# EAGLE design Child (EAGLE 7.4.0)
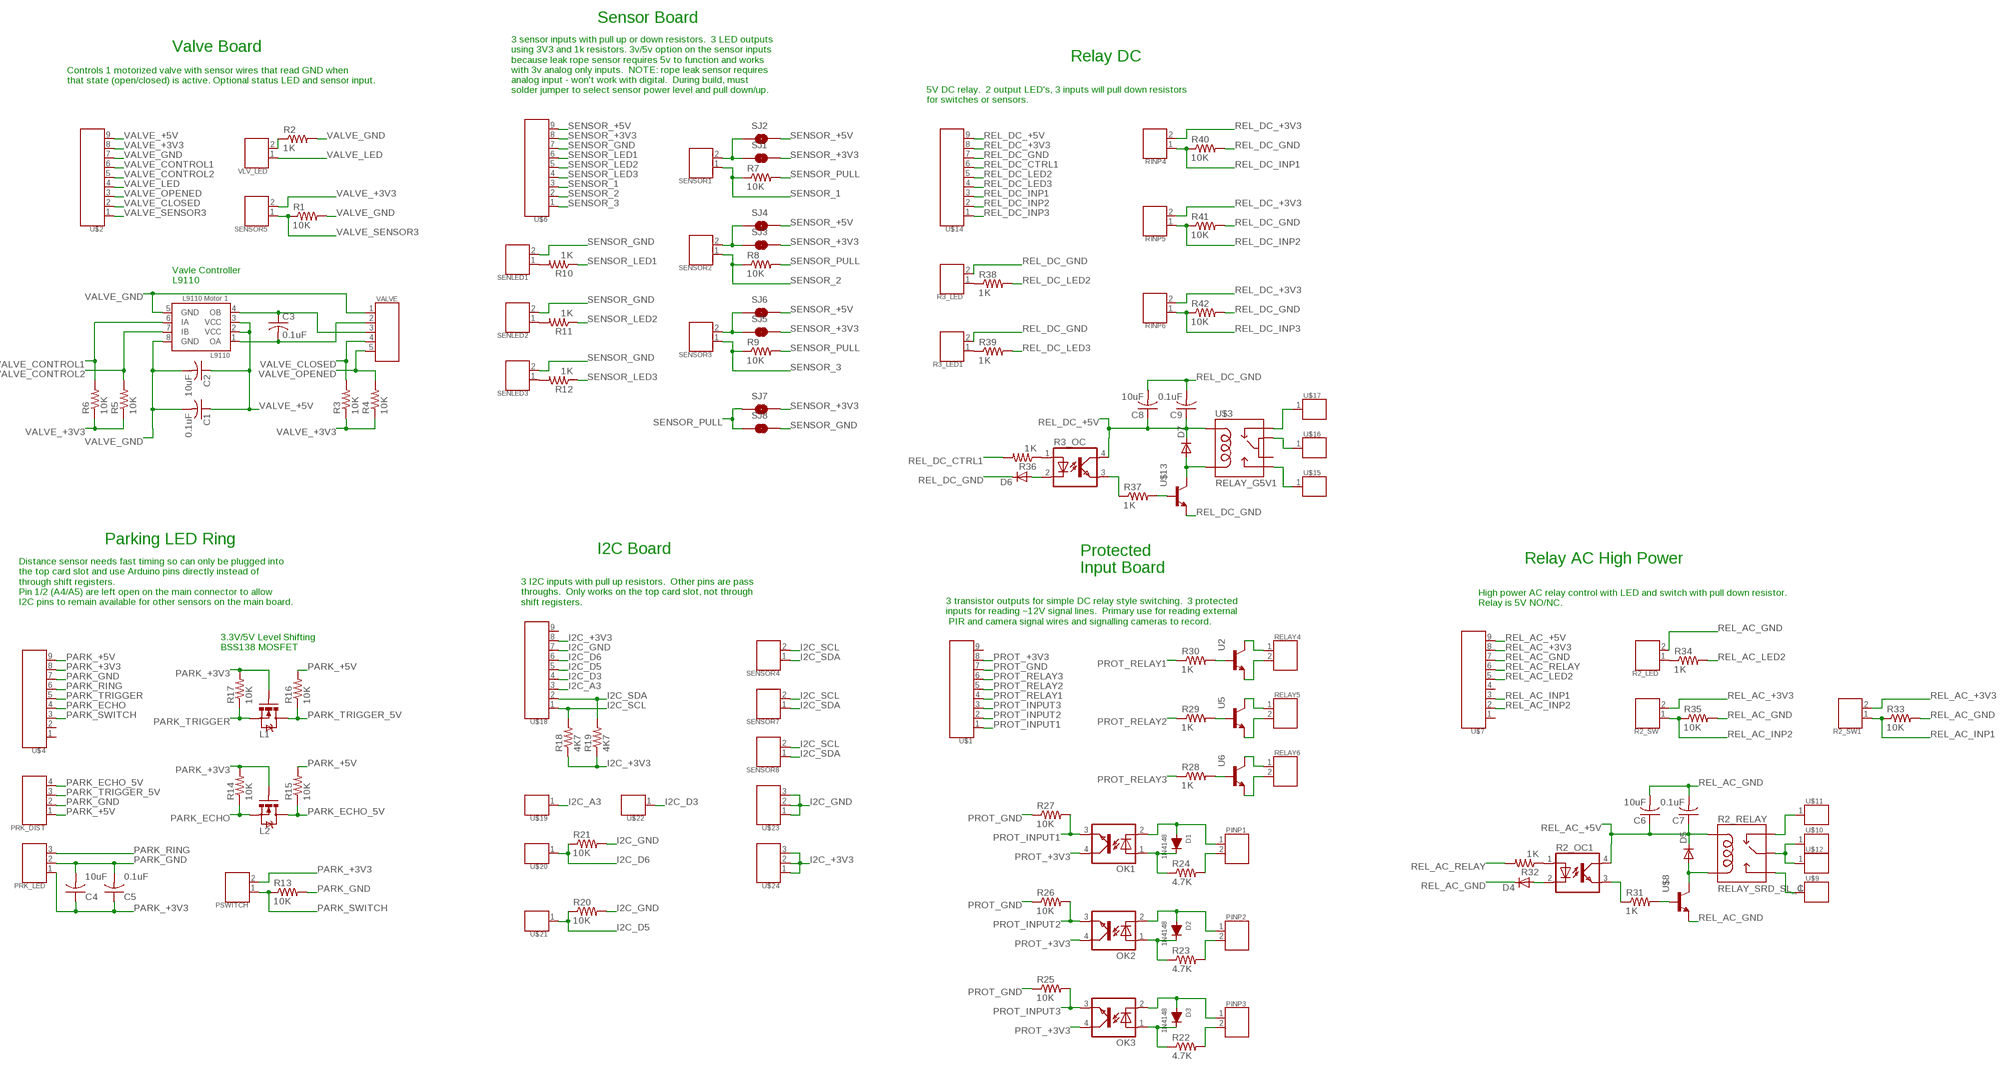
[diagram p0: schematic, sheet 1]

## Parts
C1  0.1uF  CAP_0805  [CAP_0805]
C2  10uF  CAP_0805  [CAP_0805]
C3  0.1uF  CAP_0805  [CAP_0805]
C4  10uF  CAP_0805  [CAP_0805]
C5  0.1uF  CAP_0805  [CAP_0805]
C6  10uF  CAP_0805  [CAP_0805]
C7  0.1uF  CAP_0805  [CAP_0805]
C8  10uF  CAP_0805  [CAP_0805]
C9  0.1uF  CAP_0805  [CAP_0805]
D1  1N4148  1N4148_SOD123  [SOD123]
D2  1N4148  1N4148_SOD123  [SOD123]
D3  1N4148  1N4148_SOD123  [SOD123]
D4  DIODESOD323  [SOD323]
D5  DIODESOD323  [SOD323]
D6  DIODESOD323  [SOD323]
D7  DIODESOD323  [SOD323]
L1  MOSFET-NCHANNELSMD  [SOT23-3]
L2  MOSFET-NCHANNELSMD  [SOT23-3]
L9110  L9110 Motor 1  IC_L9110_MOTORSO8  [SO-08]
OK1  PC817SOP  [SO-4_PC817]
OK2  PC817SOP  [SO-4_PC817]
OK3  PC817SOP  [SO-4_PC817]
PINP1  CONNECTOR_2DUPONT  [DUPONT_2]
PINP2  CONNECTOR_2DUPONT  [DUPONT_2]
PINP3  CONNECTOR_2DUPONT  [DUPONT_2]
PRK_DIST  CONNECTOR_4DUPONT  [DUPONT_4]
PRK_LED  CONNECTOR_3DUPONT  [DUPONT_3]
PSWITCH  CONNECTOR_2DUPONT  [DUPONT_2]
R1  10K  R_0805  [R_0805]
R2  1K  R_0805  [R_0805]
R2_LED  CONNECTOR_2DUPONT  [DUPONT_2]
R2_OC1  PC817SOP  [SO-4_PC817]
R2_RELAY  RELAY_SRD_SL_C  [RELAY_SRD-SL-C]
R2_SW  CONNECTOR_2DUPONT  [DUPONT_2]
R2_SW1  CONNECTOR_2DUPONT  [DUPONT_2]
R3  10K  R_0805  [R_0805]
R3_LED  CONNECTOR_2DUPONT  [DUPONT_2]
R3_LED1  CONNECTOR_2DUPONT  [DUPONT_2]
R3_OC  PC817SOP  [SO-4_PC817]
R4  10K  R_0805  [R_0805]
R5  10K  R_0805  [R_0805]
R6  10K  R_0805  [R_0805]
R7  10K  R_0805  [R_0805]
R8  10K  R_0805  [R_0805]
R9  10K  R_0805  [R_0805]
R10  1K  R_0805  [R_0805]
R11  1K  R_0805  [R_0805]
R12  1K  R_0805  [R_0805]
R13  10K  R_0805  [R_0805]
R14  10K  R_0805  [R_0805]
R15  10K  R_0805  [R_0805]
R16  10K  R_0805  [R_0805]
R17  10K  R_0805  [R_0805]
R18  4K7  R_0805  [R_0805]
R19  4K7  R_0805  [R_0805]
R20  10K  R_0805  [R_0805]
R21  10K  R_0805  [R_0805]
R22  4.7K  R_0805  [R_0805]
R23  4.7K  R_0805  [R_0805]
R24  4.7K  R_0805  [R_0805]
R25  10K  R_0805  [R_0805]
R26  10K  R_0805  [R_0805]
R27  10K  R_0805  [R_0805]
R28  1K  R_0805  [R_0805]
R29  1K  R_0805  [R_0805]
R30  1K  R_0805  [R_0805]
R31  1K  R_0805  [R_0805]
R32  1K  R_0805  [R_0805]
R33  10K  R_0805  [R_0805]
R34  1K  R_0805  [R_0805]
R35  10K  R_0805  [R_0805]
R36  1K  R_0805  [R_0805]
R37  1K  R_0805  [R_0805]
R38  1K  R_0805  [R_0805]
R39  1K  R_0805  [R_0805]
R40  10K  R_0805  [R_0805]
R41  10K  R_0805  [R_0805]
R42  10K  R_0805  [R_0805]
RELAY4  CONNECTOR_2DUPONT  [DUPONT_2]
RELAY5  CONNECTOR_2DUPONT  [DUPONT_2]
RELAY6  CONNECTOR_2DUPONT  [DUPONT_2]
RINP4  CONNECTOR_2DUPONT  [DUPONT_2]
RINP5  CONNECTOR_2DUPONT  [DUPONT_2]
RINP6  CONNECTOR_2DUPONT  [DUPONT_2]
SENLED1  CONNECTOR_2DUPONT  [DUPONT_2]
SENLED2  CONNECTOR_2DUPONT  [DUPONT_2]
SENLED3  CONNECTOR_2DUPONT  [DUPONT_2]
SENSOR1  CONNECTOR_2DUPONT  [DUPONT_2]
SENSOR2  CONNECTOR_2DUPONT  [DUPONT_2]
SENSOR3  CONNECTOR_2DUPONT  [DUPONT_2]
SENSOR4  CONNECTOR_2DUPONT  [DUPONT_2]
SENSOR5  CONNECTOR_2DUPONT  [DUPONT_2]
SENSOR7  CONNECTOR_2DUPONT  [DUPONT_2]
SENSOR8  CONNECTOR_2DUPONT  [DUPONT_2]
SJ1  JUMPER-PAD-2-NOYES_SILK  [PAD-JUMPER-2-NO_YES_SILK]
SJ2  JUMPER-PAD-2-NOYES_SILK  [PAD-JUMPER-2-NO_YES_SILK]
SJ3  JUMPER-PAD-2-NOYES_SILK  [PAD-JUMPER-2-NO_YES_SILK]
SJ4  JUMPER-PAD-2-NOYES_SILK  [PAD-JUMPER-2-NO_YES_SILK]
SJ5  JUMPER-PAD-2-NOYES_SILK  [PAD-JUMPER-2-NO_YES_SILK]
SJ6  JUMPER-PAD-2-NOYES_SILK  [PAD-JUMPER-2-NO_YES_SILK]
SJ7  JUMPER-PAD-2-NOYES_SILK  [PAD-JUMPER-2-NO_YES_SILK]
SJ8  JUMPER-PAD-2-NOYES_SILK  [PAD-JUMPER-2-NO_YES_SILK]
U2  TRANSISTORSMD  [SOT23-3]
U5  TRANSISTORSMD  [SOT23-3]
U6  TRANSISTORSMD  [SOT23-3]
U$1  CONNECTOR_9DUP_FEM90  [DUPONT_FEM90_9]
U$2  CONNECTOR_9DUP_FEM90  [DUPONT_FEM90_9]
U$3  RELAY_G5V1  [RELAY-G5V]
U$4  CONNECTOR_9DUPONT  [DUPONT_9]
U$6  CONNECTOR_9DUP_FEM90  [DUPONT_FEM90_9]
U$7  CONNECTOR_9DUP_FEM90  [DUPONT_FEM90_9]
U$8  TRANSISTORSMD  [SOT23-3]
U$9  CONNECTOR_1DUP_LARGE  [DUPONT_1_LRG]
U$10  CONNECTOR_1DUP_LARGE  [DUPONT_1_LRG]
U$11  CONNECTOR_1DUP_LARGE  [DUPONT_1_LRG]
U$12  CONNECTOR_1DUP_LARGE  [DUPONT_1_LRG]
U$13  TRANSISTORSMD  [SOT23-3]
U$14  CONNECTOR_9DUP_FEM90  [DUPONT_FEM90_9]
U$15  CONNECTOR_1DUPONT  [DUPONT_1]
U$16  CONNECTOR_1DUPONT  [DUPONT_1]
U$17  CONNECTOR_1DUPONT  [DUPONT_1]
U$18  CONNECTOR_9DUP_FEM90  [DUPONT_FEM90_9]
U$19  CONNECTOR_1DUPONT  [DUPONT_1]
U$20  CONNECTOR_1DUPONT  [DUPONT_1]
U$21  CONNECTOR_1DUPONT  [DUPONT_1]
U$22  CONNECTOR_1DUPONT  [DUPONT_1]
U$23  CONNECTOR_3DUPONT  [DUPONT_3]
U$24  CONNECTOR_3DUPONT  [DUPONT_3]
VALVE  CONNECTOR_5DUPONT  [DUPONT_5]
VLV_LED  CONNECTOR_2DUPONT  [DUPONT_2]

## Nets
I2C_+3V3: R18.1 R19.1 U$18.8 U$24.1 U$24.2 U$24.3
I2C_A3: U$18.3 U$19.1
I2C_D3: U$18.4 U$22.1
I2C_D5: R20.1 U$18.5 U$21.1
I2C_D6: R21.1 U$18.6 U$20.1
I2C_GND: R20.2 R21.2 U$18.7 U$23.1 U$23.2 U$23.3
I2C_SCL: R18.2 SENSOR4.2 SENSOR7.2 SENSOR8.2 U$18.1
I2C_SDA: R19.2 SENSOR4.1 SENSOR7.1 SENSOR8.1 U$18.2
N$3: C3.1 L9110.4(OB) VALVE.3
N$4: C3.2 L9110.1(OA) VALVE.2
N$5: R2.1 VLV_LED.2
N$6: D1.C(K) OK1.1 R24.1
N$7: D1.A OK1.2 PINP1.1
N$8: PINP1.2 R24.2
N$9: D2.C(K) OK2.1 R23.1
N$10: D2.A OK2.2 PINP2.1
N$11: PINP2.2 R23.2
N$13: D3.C(K) OK3.1 R22.1
N$14: D3.A OK3.2 PINP3.1
N$15: PINP3.2 R22.2
N$16: R10.2 SENLED1.1
N$17: R11.2 SENLED2.1
N$18: R12.2 SENLED3.1
N$19: R30.2 U2.1(BASE)
N$21: RELAY4.1 U2.3(COLLECTOR)
N$22: RELAY4.2 U2.2(EMITTER)
N$26: SENSOR3.2 SJ5.1 SJ6.1
N$27: SENSOR2.2 SJ3.1 SJ4.1
N$28: R29.2 U5.1(BASE)
N$29: R28.2 U6.1(BASE)
N$30: R3_LED1.1 R39.1
N$31: RELAY5.1 U5.3(COLLECTOR)
N$32: RELAY5.2 U5.2(EMITTER)
N$33: RELAY6.1 U6.3(COLLECTOR)
N$34: RELAY6.2 U6.2(EMITTER)
N$35: R2_LED.1 R34.1
N$36: D5.A R2_RELAY.2(COIL_B) U$8.3(COLLECTOR)
N$37: R31.2 U$8.1(BASE)
N$38: R2_OC1.3(EMIT) R31.1
N$39: D4.A R2_OC1.2
N$40: R2_OC1.1 R32.1
N$41: D7.A U$3.9 U$13.3(COLLECTOR)
N$42: R37.2 U$13.1(BASE)
N$43: R3_OC.3(EMIT) R37.1
N$44: D6.A R3_OC.2
N$45: R3_OC.1 R36.1
N$46: R3_LED.1 R38.1
N$47: U$3.5 U$16.1
N$48: SENSOR1.2 SJ1.1 SJ2.1
PARK_+3V3: C4.1 C5.1 L1.1(G) L2.1(G) PRK_LED.1 PSWITCH.2 R14.2 R17.2 U$4.8
PARK_+5V: PRK_DIST.1 R15.2 R16.2 U$4.9
PARK_ECHO: L2.2(S) R14.1 U$4.4
PARK_ECHO_5V: L2.3(D) PRK_DIST.4 R15.1
PARK_GND: C4.2 C5.2 PRK_DIST.2 PRK_LED.2 R13.2 U$4.7
PARK_RING: PRK_LED.3 U$4.6
PARK_SWITCH: PSWITCH.1 R13.1 U$4.3
PARK_TRIGGER: L1.2(S) R17.1 U$4.5
PARK_TRIGGER_5V: L1.3(D) PRK_DIST.3 R16.1
PROT_+3V3: OK1.4(COL) OK2.4(COL) OK3.4(COL) U$1.8
PROT_GND: R25.1 R26.1 R27.1 U$1.7
PROT_INPUT1: OK1.3(EMIT) R27.2 U$1.1
PROT_INPUT2: OK2.3(EMIT) R26.2 U$1.2
PROT_INPUT3: OK3.3(EMIT) R25.2 U$1.3
PROT_RELAY1: R30.1 U$1.4
PROT_RELAY2: R29.1 U$1.5
PROT_RELAY3: R28.1 U$1.6
R2_COM: R2_RELAY.3(COM) U$10.1 U$12.1
R2_NC: R2_RELAY.5(NC) U$11.1
R2_NC1: U$3.1 U$17.1
R2_NO: R2_RELAY.4(NO) U$9.1
R2_NO1: U$3.10 U$15.1
REL_AC_+3V3: R2_SW1.2 R2_SW.2 U$7.8
REL_AC_+5V: C6.1 C7.1 D5.C R2_OC1.4(COL) R2_RELAY.1(COIL_A) U$7.9
REL_AC_GND: C6.2 C7.2 D4.C R2_LED.2 R33.2 R35.2 U$7.7 U$8.2(EMITTER)
REL_AC_INP1: R2_SW1.1 R33.1 U$7.3
REL_AC_INP2: R2_SW.1 R35.1 U$7.2
REL_AC_LED2: R34.2 U$7.5
REL_AC_RELAY: R32.2 U$7.6
REL_DC_+3V3: RINP4.2 RINP5.2 RINP6.2 U$14.8
REL_DC_+5V: C8.1 C9.1 D7.C R3_OC.4(COL) U$3.2 U$14.9
REL_DC_CTRL1: R36.2 U$14.6
REL_DC_GND: C8.2 C9.2 D6.C R3_LED1.2 R3_LED.2 R40.2 R41.2 R42.2 U$13.2(EMITTER) U$14.7
REL_DC_INP1: R40.1 RINP4.1 U$14.3
REL_DC_INP2: R41.1 RINP5.1 U$14.2
REL_DC_INP3: R42.1 RINP6.1 U$14.1
REL_DC_LED2: R38.2 U$14.5
REL_DC_LED3: R39.2 U$14.4
SENSOR_1: R7.1 SENSOR1.1 U$6.3
SENSOR_2: R8.1 SENSOR2.1 U$6.2
SENSOR_3: R9.1 SENSOR3.1 U$6.1
SENSOR_+3V3: SJ1.2 SJ3.2 SJ5.2 SJ7.2 U$6.8
SENSOR_+5V: SJ2.2 SJ4.2 SJ6.2 U$6.9
SENSOR_GND: SENLED1.2 SENLED2.2 SENLED3.2 SJ8.2 U$6.7
SENSOR_LED1: R10.1 U$6.6
SENSOR_LED2: R11.1 U$6.5
SENSOR_LED3: R12.1 U$6.4
SENSOR_PULL: R7.2 R8.2 R9.2 SJ7.1 SJ8.1
VALVE_+3V3: R3.1 R4.1 R5.1 R6.1 SENSOR5.2 U$2.8
VALVE_+5V: C1.1 C2.1 L9110.2(VCC) L9110.3(VCC) U$2.9
VALVE_CLOSED: R3.2 U$2.2 VALVE.4
VALVE_CONTROL1: L9110.6(IA) R6.2 U$2.6
VALVE_CONTROL2: L9110.7(IB) R5.2 U$2.5
VALVE_GND: C1.2 C2.2 L9110.5(GND) L9110.8(GND) R1.2 R2.2 U$2.7 VALVE.1
VALVE_LED: U$2.4 VLV_LED.1
VALVE_OPENED: R4.2 U$2.3 VALVE.5
VALVE_SENSOR3: R1.1 SENSOR5.1 U$2.1
Unconnected: U$1.9 U$3.6 U$4.1 U$4.2 U$7.1 U$7.4 U$18.9

## Notes on the sheet
- Sensor Board
- Valve Board
- Relay DC
- Controls 1 motorized valve with sensor wires that read GND when 
  that state (open/closed) is active. Optional status LED and sensor input.
- 3 sensor inputs with pull up or down resistors.  3 LED outputs
  using 3V3 and 1k resistors. 3v/5v option on the sensor inputs
  because leak rope sensor requires 5v to function and works
  with 3v analog only inputs.  NOTE: rope leak sensor requires
  analog input - won't work with digital.  During build, must 
  solder jumper to select sensor power level and pull down/up.
- 5V DC relay.  2 output LED's, 3 inputs will pull down resistors
  for switches or sensors.
- Vavle Controller
  L9110
- Parking LED Ring
- I2C Board
- Relay AC High Power
- Protected
  Input Board
- Distance sensor needs fast timing so can only be plugged into
  the top card slot and use Arduino pins directly instead of 
  through shift registers.  
  Pin 1/2 (A4/A5) are left open on the main connector to allow
  I2C pins to remain available for other sensors on the main board.
- 3 I2C inputs with pull up resistors.  Other pins are pass
  throughs.  Only works on the top card slot, not through
  shift registers.
- High power AC relay control with LED and switch with pull down resistor.
  Relay is 5V NO/NC.
- 3 transistor outputs for simple DC relay style switching.  3 protected
  inputs for reading ~12V signal lines.  Primary use for reading external
   PIR and camera signal wires and signalling cameras to record.
- 3.3V/5V Level Shifting
  BSS138 MOSFET

## Library data of the parts
C1-C9 = TD22057:CAP_0805
D1-D3 = diodes:1N4148: General purpose diode 1N4148W Datasheet: \diodes-datasheets\1N4148W.pdf Features: • Fast switching device (TRR<4 nS) • General purpose diodes • Flat lead SOD-123 small outline plastic package • Surface device type mounting • Moisture sensitivity level 1 • Clip bonding construction, good thermal capability • Pb free version • Matte tin (Sn) lead finish with nickel (Ni) underplate • Band indicates cathode Electrical Characteristics Power Dissipation 400mW Repetitive Peak Reverse Voltage 75V Continuous Forward Current 150mA; MPN: 1N4148W; OC_FARNELL: 1651821; PACKAGE: SOD123; SUPPLIER: MULTICOMP
D4-D7 = TD22057:DIODE: DIODE high speed (Philips)
L1 L2 = TD22057:MOSFET-NCHANNEL: BSS138 Logic Level converter 5V->3.3V
L9110 = TD22057:IC_L9110_MOTOR
OK1-OK3 R2_OC1 R3_OC = TD22057:PC817: EL817 Opto Coupler
PINP1-PINP3 PSWITCH R2_LED R2_SW R2_SW1 R3_LED R3_LED1 RELAY4-RELAY6 RINP4-RINP6 SENLED1-SENLED3 SENSOR1-SENSOR5 SENSOR7 SENSOR8 VLV_LED = TD22057:CONNECTOR_2: 2 Pin connector
PRK_DIST = TD22057:CONNECTOR_4
PRK_LED U$23 U$24 = TD22057:CONNECTOR_3
R1-R42 = TD22057:R_0805
R2_RELAY = TD22057:RELAY_SRD_SL_C
SJ1-SJ8 = TD22057:JUMPER-PAD-2-NO
U2 U5 U6 U$8 U$13 = TD22057:TRANSISTOR
U$1 U$2 U$4 U$6 U$7 U$14 U$18 = TD22057:CONNECTOR_9
U$3 = TD22057:RELAY_G5V1
U$9-U$12 U$15-U$17 U$19-U$22 = TD22057:CONNECTOR_1
VALVE = TD22057:CONNECTOR_5

## Board
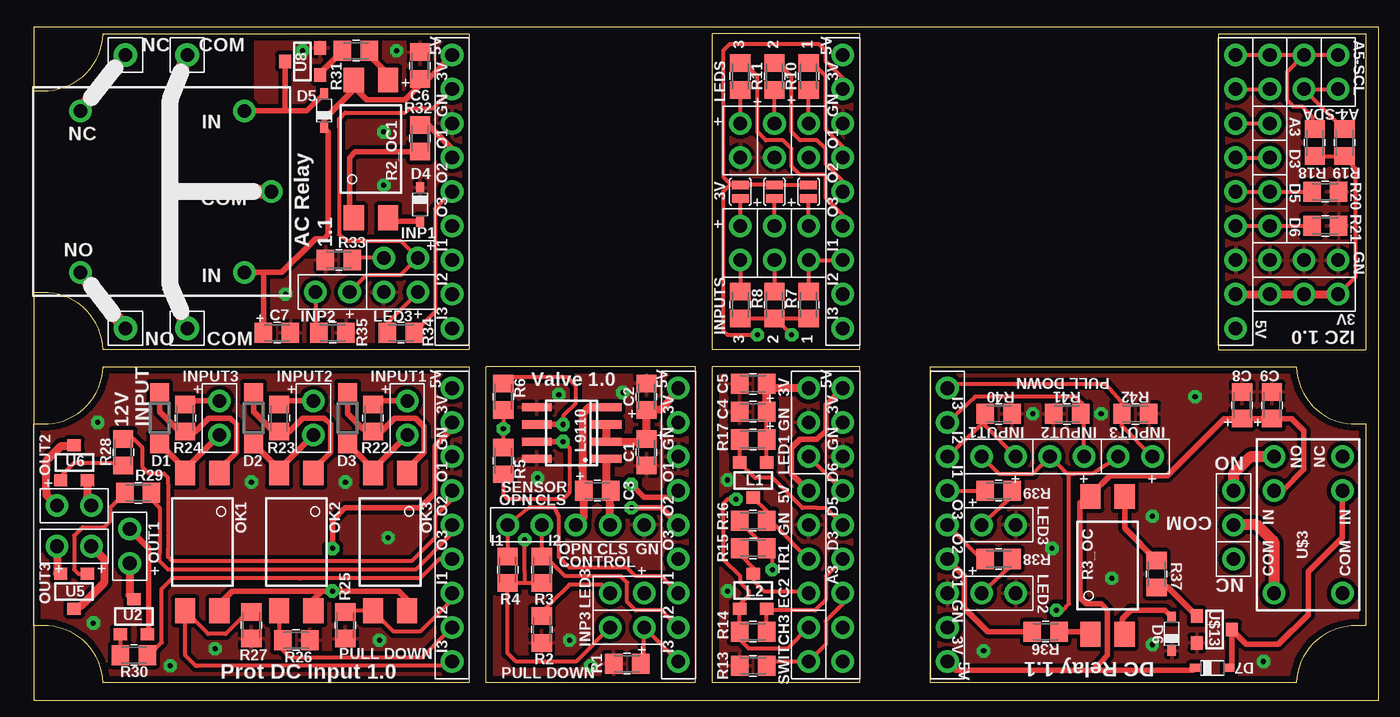
[diagram p1: board, top side]
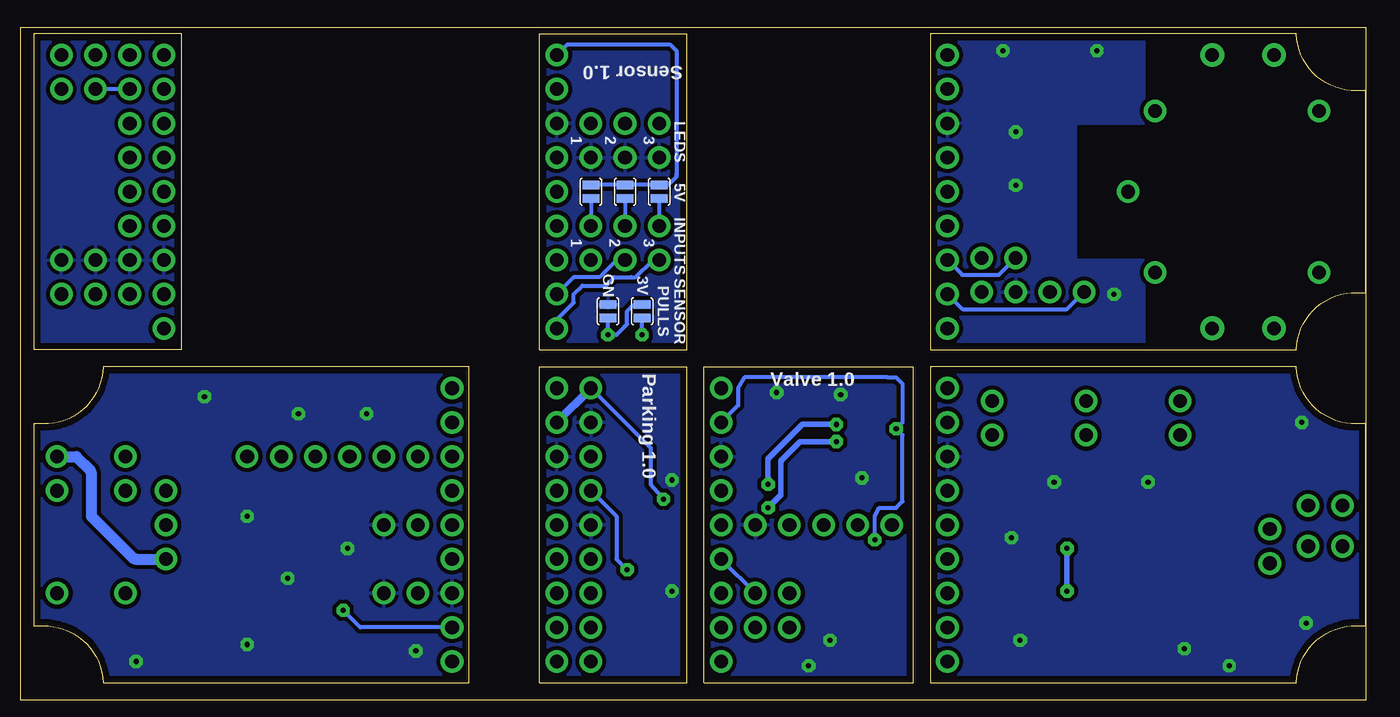
[diagram p2: board, bottom side, seen from below]

Size 99.06 x 48.26 mm. Coordinates in mm from the lower left corner, seen from the top.
Outline: 5.17,0 arc90 0.67,4.25 0,4.25 0,19.25 0.67,19.25 arc90 5.17,23.5 32.38,23.5 32.38,0 5.17,0
Outline: 49.21,0 49.21,23.5 33.66,23.5 33.66,0 49.21,0
Outline: 61.44,24.77 61.44,48.26 50.48,48.26 50.48,24.77 61.44,24.77
Outline: 61.44,0 61.44,23.5 50.48,23.5 50.48,0 61.44,0
Outline: 5.17,24.77 arc90 0.67,29.01 0,29.01 0,44.02 0.67,44.02 arc90 5.17,48.26 32.38,48.26 32.38,24.77 5.17,24.77
Outline: 93.89,23.5 arc90 98.39,19.25 99.06,19.25 99.06,4.24 98.39,4.24 arc90 93.89,0 66.67,0 66.67,23.5 93.89,23.5
Outline: 88.11,24.77 99.06,24.77 99.06,48.26 88.11,48.26 88.11,24.77
Copper layers (1*2*15*16): Top 0.035mm / dielectric 0.2mm / layer 2 0.035mm / dielectric 1.2mm / layer 15 0.035mm / dielectric 0.2mm / Bottom 0.035mm
Design rules "Elecrow_PCB_eagle_rule": minimum track width 6mil, minimum drill 12mil, track to track 6mil, track to pad 8mil, pad to pad 12mil, via to via 6mil, smd to smd 0mil, copper to edge 20mil, drill to drill 10mil, minimum pad ring 6mil, minimum via ring 6mil, stop-mask expansion 0mil, vias tented up to drill 100mil, thermal gap 10mil
tKeepout: area 15.2,34 to 20.3,39.1
Milling: 6 lines

### Footprints (pad centres in the part's own frame; a part is rotated, then mirrored left to right if it is on the bottom)
CAP_0805 = smd 1.3 x 1.5: 1 -1,0; 2 1,0
SOD123 = smd 1.4 x 1.4: A 1.9,0; C -1.9,0
SOD323 = smd 0.8 x 0.6: A 1.25,0; C -1.25,0
SOT23-3 = smd 1 x 0.9: 1 -1,-1.3; 2 1,-1.3; 3 0,1.3
SO-08 = smd 0.6 x 2.2: 1 -1.905,-2.6; 2 -0.635,-2.6; 3 0.635,-2.6; 4 1.905,-2.6; 5 1.905,2.6; 6 0.635,2.6; 7 -0.635,2.6; 8 -1.905,2.6
SO-4_PC817 = smd 1.85 x 1.5: 1 -5.125,1.27; 2 -5.125,-1.27; 3 5.125,-1.27; 4 5.125,1.27
DUPONT_2 = drill 1.016 pad 1.676: 1 -1.27,0; 2 1.27,0
DUPONT_4 = drill 1.016 pad 1.676: 1 -3.81,0; 2 -1.27,0; 3 1.27,0; 4 3.81,0
DUPONT_3 = drill 1.016 pad 1.676: 1 -2.54,0; 2 0,0; 3 2.54,0
R_0805 = smd 1.3 x 1.5: 1 -1,0; 2 1,0
RELAY_SRD-SL-C = drill 1.016 pad 1.676: 1 -6.15,6; 2 -6.15,-6; 3 -8.15,0; 4 6.05,6; 5 6.05,-6
PAD-JUMPER-2-NO_YES_SILK = smd 0.635 x 1.27: 1 -0.501,0; 2 0.501,0
DUPONT_FEM90_9 = drill 1.016 pad 1.676: 1 -10.16,0; 2 -7.62,0; 3 -5.08,0; 4 -2.54,0; 5 0,0; 6 2.54,0; 7 5.08,0; 8 7.62,0; 9 10.16,0
RELAY-G5V = drill 1.016 pad 1.676: 1 5.08,2.54; 2 2.54,2.54; 5 -5.08,2.54; 6 -5.08,-2.54; 9 2.54,-2.54; 10 5.08,-2.54
DUPONT_9 = drill 1.016 pad 1.676: 1 -10.16,0; 2 -7.62,0; 3 -5.08,0; 4 -2.54,0; 5 0,0; 6 2.54,0; 7 5.08,0; 8 7.62,0; 9 10.16,0
DUPONT_1_LRG = drill 1.016 pad 1.778: 1 0,0
DUPONT_1 = drill 1.016 pad 1.676: 1 0,0
DUPONT_5 = drill 1.016 pad 1.676: 1 -5.08,0; 2 -2.54,0; 3 0,0; 4 2.54,0; 5 5.08,0

### Placement (x,y rotation side)
C1  45.56,17.14 270 top
C2  45.56,21.27 90 top
C3  41.91,14.29 0 top
C4  53.5,20.16 180 top
C5  53.5,22.23 180 top
C6  28.73,45.88 90 top
C7  18.1,26.04 0 top
C8  89.85,20.64 90 top
C9  92.08,20.64 90 top
D1  9.37,19.68 270 top
D2  16.35,19.68 270 top
D3  23.34,19.68 270 top
D4  28.73,35.56 270 top
D5  21.59,42.54 90 top
D6  84.61,3.65 90 top
D7  87.63,1.11 0 top
L1  53.5,15.08 180 top
L2  53.5,6.83 0 top
L9110  40.01,18.57 90 top
OK1  12.54,10.48 270 top
OK2  19.53,10.48 270 top
OK3  26.51,10.48 270 top
PINP1  13.81,19.68 90 top
PINP2  20.8,19.68 90 top
PINP3  27.78,19.68 90 top
PRK_DIST  57.63,10.48 270 top
PRK_LED  57.63,19.37 270 top
PSWITCH  57.63,2.86 90 top
R1  44.13,1.43 180 top
R2  37.78,3.97 270 top
R2_LED  27.3,29.05 180 top
R2_OC1  25.08,39.69 90 top
R2_RELAY  9.53,36.51 180 top
R2_SW  22.23,29.05 0 top
R2_SW1  27.3,31.59 0 top
R3  37.78,8.41 90 top
R3_LED  71.75,6.67 0 top
R3_LED1  71.75,11.75 0 top
R3_OC  79.85,8.73 90 top
R4  35.24,8.41 90 top
R5  34.92,16.51 270 top
R6  34.92,21.27 90 top
R7  57.63,28.1 270 top
R8  55.09,28.1 270 top
R9  52.55,28.1 270 top
R10  57.63,45.08 270 top
R11  55.09,45.08 270 top
R12  52.55,45.08 270 top
R13  53.5,1.27 180 top
R14  53.5,3.81 180 top
R15  53.5,10 0 top
R16  53.5,12.07 180 top
R17  53.5,18.1 0 top
R18  95.25,40.16 90 top
R19  97.47,40.16 90 top
R20  96.04,36.51 0 top
R21  96.04,33.97 0 top
R22  25.24,19.68 90 top
R23  18.26,19.68 90 top
R24  11.27,19.68 90 top
R25  23.18,4.29 90 top
R26  19.53,3.18 180 top
R27  16.19,4.29 90 top
R28  6.67,17.14 270 top
R29  7.78,14.13 180 top
R30  7.46,2.06 180 top
R31  23.97,46.99 180 top
R32  28.73,40.48 90 top
R33  22.7,31.43 180 top
R34  27.3,26.04 0 top
R35  22.23,26.04 0 top
R36  75.25,3.81 180 top
R37  83.5,8.1 270 top
R38  71.75,9.21 180 top
R39  71.75,14.29 180 top
R40  71.75,20 0 top
R41  76.83,20 180 top
R42  81.92,20 0 top
RELAY4  7.14,10.16 90 top
RELAY5  3.02,10.16 180 top
RELAY6  3.02,13.18 0 top
RINP4  71.75,16.83 180 top
RINP5  76.83,16.83 180 top
RINP6  81.92,16.83 180 top
SENLED1  57.63,40.32 270 top
SENLED2  55.09,40.32 270 top
SENLED3  52.55,40.32 270 top
SENSOR1  57.63,32.7 90 top
SENSOR2  55.09,32.7 90 top
SENSOR3  52.55,32.7 90 top
SENSOR4  97,45.4 90 top
SENSOR5  44.13,4.13 180 top
SENSOR7  91.92,45.4 90 top
SENSOR8  94.46,45.4 90 top
SJ1  57.63,36.51 90 top
SJ2  57.63,36.51 90 bottom
SJ3  55.09,36.51 90 top
SJ4  55.09,36.51 90 bottom
SJ5  52.55,36.51 90 top
SJ6  52.55,36.51 90 bottom
SJ7  53.82,27.62 270 bottom
SJ8  56.36,27.62 90 bottom
U2  7.46,4.92 0 top
U5  3.02,6.83 180 top
U6  3.02,16.35 0 top
U$1  31.11,11.75 90 top
U$2  47.94,11.75 90 top
U$3  94.77,11.75 90 top
U$4  60.17,11.75 90 top
U$6  60.17,36.51 90 top
U$7  31.11,36.51 90 top
U$8  20,46.2 90 top
U$9  6.83,26.35 270 top
U$10  11.43,26.35 270 top
U$11  6.83,46.67 270 top
U$12  11.43,46.67 270 top
U$13  87.79,3.97 270 top
U$14  67.94,11.75 270 top
U$15  89.22,9.21 90 top
U$16  89.22,11.75 90 top
U$17  89.22,14.29 90 top
U$18  89.38,36.51 270 top
U$19  91.92,41.59 270 top
U$20  91.92,33.97 270 top
U$21  91.92,36.51 270 top
U$22  91.92,39.05 270 top
U$23  94.46,31.43 0 top
U$24  94.46,28.89 0 top
VALVE  40.32,11.75 180 top
VLV_LED  44.13,6.67 180 top

### Tracks (layer width: path | path; a pad name or v marks a point on that pad's centre or on a via)
I2C_+3V3
  Top 0.305: R18.1 R19.1 97.47,39.05 98.27,38.26 98.27,30.16 U$24.3
  Top 0.61: U$18.8 U$24.1 U$24.2 U$24.3
I2C_A3
  Top 0.305: U$18.3 U$19.1
I2C_D3
  Top 0.305: U$18.4 U$22.1
I2C_D5
  Top 0.305: U$18.5 U$21.1 R20.1
I2C_D6
  Top 0.305: U$18.6 U$20.1 R21.1
I2C_GND
  pour Top (isolate 0.305): 88.11,24.77 99.06,24.77 99.06,48.26 88.11,48.26
  pour Bottom (isolate 0.279): 88.11,24.77 99.06,24.77 99.06,48.26 88.11,48.26
I2C_SCL
  Top 0.305: SENSOR8.2 SENSOR4.2 | SENSOR8.2 SENSOR7.2 U$18.1 | 95.36,40.69 R18.2 95.09,41.32 95.09,42.07 94.3,42.86 93.66,42.86 93.19,43.34 93.19,45.4 SENSOR8.2
I2C_SDA
  Top 0.305: U$18.2 SENSOR7.1 | SENSOR4.1 SENSOR8.1 96.95,41.64 97,41.64 R19.2
  Bottom 0.305: SENSOR7.1 SENSOR8.1
N$3
  Top 0.61: L9110.4 41.27,20.48 40.8,20 40.8,16.19 40.8,16.03 40.8,14.4 C3.1 40.91,12.34 VALVE.3
N$4
  Top 0.305: 42.55,16.61 L9110.1 | L9110.1 42.7,16.57 L9110.1
  Top 0.61: L9110.1 42.6,14.59 C3.2 42.86,14.24 42.86,13.18 VALVE.2
N$5
  Top 0.305: VLV_LED.2 42.23,7.3 39.85,7.3 38.42,5.87 37.78,5.24 R2.1
N$6
  Top 0.406: D1.C 9.37,20.16 10.84,18.68 R24.1 12.02,18.68 13.02,19.68 14.61,19.68 15.08,19.21 15.08,17.14 13.81,15.88 OK1.1
N$7
  Top 0.406: PINP1.1 11.27,15.88 OK1.2 11.27,15.88 D1.A
N$8
  Top 0.406: PINP1.2 11.54,20.96 R24.2
N$9
  Top 0.406: D2.C 16.35,20.16 17.62,18.89 18.05,18.89 R23.1 19,18.68 20,19.68 21.59,19.68 22.07,19.21 22.07,17.14 20.8,15.88 OK2.1
N$10
  Top 0.406: PINP2.1 18.26,15.88 OK2.2 18.26,15.88 D2.A
N$11
  Top 0.406: PINP2.2 18.53,20.96 R23.2
N$13
  Top 0.406: D3.C 23.34,20 24.45,18.89 25.04,18.89 R22.1 25.83,18.68 26.83,19.68 28.42,19.68 29.05,19.05 29.05,17.14 27.78,15.88 OK3.1
N$14
  Top 0.406: PINP3.1 25.24,15.88 OK3.2 25.24,15.88 D3.A
N$15
  Top 0.406: PINP3.2 25.51,20.96 R22.2
N$16
  Top 0.305: SENLED1.1 R10.2
N$17
  Top 0.305: SENLED2.1 R11.2
N$18
  Top 0.305: SENLED3.1 R12.2
N$19
  Top 0.305: R30.2 U2.1
N$21
  Top 0.61: RELAY4.1 7.14,6.54 U2.3
N$22
  Top 0.406: 8.57,3.73 8.57,9.84 8.57,10 RELAY4.2
  Top 0.61: 8.57,3.73 U2.2
N$26
  Top 0.305: SENSOR3.2 SJ6.1
  Bottom 0.305: SJ6.1 SENSOR3.2
N$27
  Top 0.305: SENSOR2.2 SJ4.1
  Bottom 0.305: SJ4.1 SENSOR2.2
N$28
  Top 0.305: U5.1 3.99,8.1 3.33,8.1 3.02,8.41 3.02,10.95 3.49,11.43 3.65,11.59 5.24,11.59 5.71,12.07 5.71,13.07 R29.2
N$29
  Top 0.305: U6.1 2.02,15.35 3.02,16.35 6.46,16.35 R28.2
N$30
  Top 0.305: R3_LED1.1 72.91,14.02 R39.1
N$31
  Top 0.61: RELAY5.1 5.24,9.21 5.24,7.46 3.97,6.19 3.49,5.71 U5.3
N$32
  Top 0.61: RELAY5.2 1.75,8.15 U5.2
N$33
  Top 0.61: U6.3 2.99,17.62 2.06,17.62 0.95,16.51 0.95,16.19 0.95,14.29 0.95,13.97 RELAY6.1
N$34
  Top 0.61: U6.2 3.97,13.5 RELAY6.2
N$35
  Top 0.305: R2_LED.1 26.3,26.78 R34.1
N$36
  Top 0.406: 18.57,42.51 19.53,42.51 20.31,42.51 D5.A | 18.57,42.51 R2_RELAY.2 | U$8.3 18.7,42.64 18.57,42.51
N$37
  Top 0.406: U$8.1 21.3,45.32 R31.2
N$38
  Top 0.406: 26.4,45.08 R2_OC1.3 26.51,45.08 26.19,45.4 24.97,46.62 R31.1
N$39
  Top 0.406: D4.A 26.61,34.31 R2_OC1.2
N$40
  Top 0.406: R32.1 23.92,39.48 23.5,39.05 23.5,34.88 R2_OC1.1
N$41
  Top 0.406: U$3.9 97.31,10.79 94.77,8.26 94.77,5.08 92.55,2.86 90.17,2.86 89.09,3.94 U$13.3 89.09,1.32 D7.A
N$42
  Top 0.406: R37.2 83.23,7.14 84.31,7.14 U$13.1
N$43
  Top 0.406: R3_OC.3 81.12,11.48 R37.1
N$44
  Top 0.406: D6.A 84.12,5.4 81.92,5.4 81.6,5.4 80.96,4.76 80.96,4.08 R3_OC.2
N$45
  Top 0.406: R36.1 77.83,3.81 R3_OC.1
N$46
  Top 0.305: R3_LED.1 72.6,8.62 R38.1
N$47
  Top 0.813: U$3.5 92.23,10.35 arc45 92.14,10.57 90.96,11.75 U$16.1
N$48
  Top 0.305: SENSOR1.2 SJ2.1
  Bottom 0.305: SJ2.1 SENSOR1.2
PARK_+3V3  (via drill 0.38 pad 0.99)
  Top 0.305: C4.1 R17.2 L1.1 | PSWITCH.2 56.04,2.54 53.98,2.54 53.18,2.54 52.55,3.18 52.55,3.76 R14.2 L2.1 52.55,5.57 52.55,5.87 53.18,6.51 53.18,6.83 52.55,7.46 52.55,7.94 51.28,9.21 51.28,12.38 51.28,12.86 51.28,13.34 51.59,13.65 v52.23,13.65
  Top 0.61: PRK_LED.1 54.66,21.91 C5.1 C4.1
  Bottom 0.305: PRK_LED.1 53.18,17.46 53.18,14.92 53.18,14.76 v52.23,13.65
  Bottom 0.61: U$4.8 PRK_LED.1
PARK_+5V  (via drill 0.38 pad 0.99)
  Top 0.305: v54.93,8.41 54.93,9.57 R15.2 52.5,12 R16.2
  Top 0.406: U$4.9 58.9,20.64 58.9,19.37 58.9,18.73 58.26,18.1 56.99,18.1 56.36,17.46 56.36,15.56 PRK_DIST.1
  Bottom 0.305: PRK_DIST.1 55.72,12.38 55.72,9.21 v54.93,8.41
PARK_ECHO
  Top 0.305: R14.1 L2.2 54.63,5.4 58.1,5.4 58.9,6.19 58.9,7.94 U$4.4
PARK_ECHO_5V
  Top 0.305: PRK_DIST.4 57.47,6.83 54.29,6.83 53.53,7.59 53.53,7.62 L2.3 53.5,8.57 52.7,9.37 52.7,9.79 R15.1
PARK_GND  (via drill 0.38 pad 0.99)
  other vias: 51.59,15.08 51.59,6.83
  pour Top (isolate 0.305): 61.44,23.5 50.48,23.5 50.48,0 61.44,0
  pour Bottom (isolate 0.305): 61.44,23.5 50.48,23.5 50.48,0 61.44,0
PARK_RING
  Top 0.305: PRK_LED.3 58.9,15.56 U$4.6
PARK_SWITCH
  Top 0.305: R13.1 54.82,1.59 PSWITCH.1 58.9,2.86 58.9,4.6 60.17,5.87 U$4.3
PARK_TRIGGER
  Top 0.305: U$4.5 58.9,13.02 58.26,13.02 57.15,13.02 55.56,14.61 54.93,15.24 53.64,15.24 L1.2 R17.1
PARK_TRIGGER_5V
  Top 0.305: L1.3 54.5,12.78 R16.1 54.82,11.75 55.09,11.75 PRK_DIST.3
PROT_+3V3  (via drill 0.38 pad 0.99)
  Top 0.406: 21.43,6.83 15.88,6.83 14.76,6.83 13.97,6.03 13.97,5.51 OK1.4 | 21.43,6.83 v22.23,6.83 27.15,6.83 27.78,6.19 OK3.4 | U$1.8 31.11,18.89 29.84,17.62 29.84,14.13 28.73,13.02 23.18,13.02 22.23,12.07 v22.23,10 | OK2.4 20.8,6.19 21.43,6.83
  Bottom 0.406: v22.23,6.83 22.23,9.21 v22.23,10
PROT_GND  (via drill 0.38 pad 0.99)
  other vias: 25.72,3.18 10.16,1.27 13.49,2.54 23.18,14.92 4.45,4.45 16.19,14.92 4.76,19.37 26.35,10.79
  pour Top (isolate 0.305): 32.38,0 32.38,23.5 5.08,23.5 arc-90 0.95,19.21 0,19.21 0,4.29 0.79,4.29 arc-90 5.08,0
  pour Bottom (isolate 0.305): 32.38,0 32.38,23.5 5.08,23.5 arc-90 0.95,19.21 0,19.21 0,4.29 0.79,4.29 arc-90 5.08,0
PROT_INPUT1
  Top 0.305: U$1.1 30.64,1.27 12.22,1.27 12.06,1.27 11.27,2.06 11.27,4.6 11.65,4.98 | R27.2 16.19,5.56 14.29,3.65 12.97,3.65 11.65,4.98 | 11.65,4.98 OK1.3
PROT_INPUT2
  Top 0.305: OK2.3 18.26,3.13 R26.2 18.53,2.43 19.05,1.9 28.89,1.9 U$1.2
PROT_INPUT3
  Top 0.305: U$1.3 31.11,6.19 28.73,3.81 26.78,3.81 OK3.3 23.43,5.35 R25.2
PROT_RELAY1
  Top 0.305: R30.1 8.62,2.22 8.73,2.22 9.53,3.02 9.53,6.99 10.32,7.78 19.84,7.78 28.73,7.78 30.16,9.21 U$1.4
PROT_RELAY2
  Top 0.305: R29.1 8.78,13.61 9.37,13.02 9.37,9.68 9.37,9.05 10,8.41 19.68,8.41 28.42,8.41 31.11,11.11 U$1.5
PROT_RELAY3
  Top 0.305: U$1.6 31.11,13.65 29.84,12.38 29.84,10.79 28.1,9.05 19.68,9.05 10.32,9.05 10,9.37 10,10 10,10.95 10,14.81 10,15.24 9.68,15.56 8.57,15.56 8.1,16.03 8.1,17.46 7.46,18.1 6.71,18.1 R28.1
R2_COM
  Top 1.016: R2_RELAY.3 10.79,36.51 10.16,36.51 | U$12.1 10.16,43.5 10.16,36.51 | U$10.1 10.16,29.53 10.16,36.51
R2_NC
  Top 1.016: U$11.1 R2_RELAY.5
R2_NC1
  Top 0.813: U$3.1 90.62,16.83 arc45 90.39,16.73 89.85,16.19 89.31,15.65 arc45 89.22,15.43 U$17.1
R2_NO
  Top 1.016: R2_RELAY.4 U$9.1
R2_NO1
  Bottom 0.813: U$3.10 95.89,16.83 94.87,15.81 arc45 94.77,15.59 94.77,12.38 91.69,9.3 arc-45 91.47,9.21 U$15.1
REL_AC_+3V3
  Top 0.305: R2_SW.2 24.77,30.32 27.3,30.32 R2_SW1.2 27.3,32.86 23.34,32.86 22.7,33.34 22.7,41.27 22.7,41.91 23.18,42.39 27.62,42.39 27.94,42.7 29.69,42.7 U$7.8
REL_AC_+5V
  Top 0.406: R2_RELAY.1 17.14,30.51 | 17.14,30.51 18.26,30.51 18.45,30.51 20.48,32.54 20.95,33.02 21.59,33.02 21.91,33.34 21.91,40.98 D5.C 21.59,41.91 23.89,44.21 | R2_OC1.4 23.97,44.29 23.89,44.21 | C7.1 17.1,30.46 17.14,30.51 | U$7.9 29.32,44.88 C6.1 28.73,44.45 27.62,43.34 24.77,43.34 23.89,44.21
REL_AC_GND  (via drill 0.38 pad 0.99)
  other vias: 20,46.99 26.99,46.99 26.04,36.99 26.04,40.96 18.73,28.89
  pour Top (isolate 0.305): 32.38,48.26 32.38,24.77 16.51,24.77 16.51,31.43 21.59,31.43 21.59,41.59 16.51,41.59 16.51,48.26
  pour Bottom (isolate 0.305): 32.38,48.26 32.38,24.77 16.51,24.77 16.51,31.43 21.59,31.43 21.59,41.59 16.51,41.59 16.51,48.26
REL_AC_INP1
  Top 0.305: R2_SW1.1 23.86,31.59 R33.1
  Bottom 0.305: U$7.3 30,30.32 27.3,30.32 R2_SW1.1
REL_AC_INP2
  Top 0.305: R2_SW.1 20.95,26.15 R35.1
  Bottom 0.305: U$7.2 30,27.78 22.23,27.78 R2_SW.1
REL_AC_LED2
  Top 0.305: U$7.5 29.84,35.24 29.84,31.27 29.84,27.78 29.84,27.57 R34.2
  Top 0.406: 28.26,25.92 R34.2
REL_AC_RELAY
  Top 0.406: U$7.6 31.11,39.69 29.21,41.59 28.84,41.59 R32.2
REL_DC_+3V3  (via drill 0.38 pad 0.99)
  Top 0.305: RINP4.2 71.75,15.56 72.87,15.56 74.3,15.56 RINP5.2 76.6,15.8 | 76.68,15.72 76.6,15.8 | RINP6.2 78.74,15.56 77.47,15.56 | v76.04,5.4 76.52,5.4 76.99,5.87 76.99,15.56 | 77.47,15.56 76.99,15.56 | 76.6,15.8 76.83,15.56 76.99,15.56 | 76.99,15.56 77.47,15.56
  Bottom 0.305: U$14.8 74.77,4.13 v76.04,5.4
REL_DC_+5V
  Top 0.406: 78.74,0.95 81.76,0.95 86.22,0.95 D7.C | R3_OC.4 77.79,13.38 77.79,6.35 78.26,5.87 79.38,5.87 79.85,5.4 79.85,2.06 79.38,1.59 78.74,0.95 | R3_OC.4 78.58,14.45 | U$3.2 92.87,14.29 94.46,15.88 94.46,18.41 94.46,18.73 93.55,19.64 C9.1 | 92.6,19.68 C9.1 | C9.1 C8.1 88.53,19.64 84.77,15.88 84.3,15.4 80.17,15.4 80.01,15.4 79.38,14.76 78.58,13.97 R3_OC.4 | U$14.9 68.58,0.95 78.74,0.95
REL_DC_CTRL1
  Top 0.406: U$14.6 69.22,7.94 69.22,5.87 69.22,5.56 70.96,3.81 R36.2
REL_DC_GND  (via drill 0.38 pad 0.99)
  other vias: 75.72,10 91.44,1.59 79.38,20 74.3,20 80.17,7.78 86.36,21.27 70.64,2.38 83.19,2.86 83.19,12.38
  pour Top (isolate 0.305): 66.67,23.5 66.67,0 93.98,0 arc-90 98.11,4.29 99.06,4.29 99.06,19.21 98.27,19.21 arc-90 93.98,23.5
  pour Bottom (isolate 0.305): 66.67,23.5 66.67,0 93.98,0 arc-90 98.11,4.29 99.06,4.29 99.06,19.21 98.27,19.21 arc-90 93.98,23.5
REL_DC_INP1
  Top 0.305: RINP4.1 70.75,19.1 R40.1 70.75,19.48 U$14.3
REL_DC_INP2
  Top 0.305: RINP5.1 78.11,19.73 R41.1 77.95,20.11 77.95,20.8 77.47,21.27 70.01,21.27 U$14.2
REL_DC_INP3
  Top 0.305: RINP6.1 80.92,19.1 R42.1 | U$14.1 68.26,22.23 75.56,22.23 79.69,22.23 80.8,20.96 80.92,20.84 R42.1 | 80.8,20.11 R42.1
REL_DC_LED2
  Top 0.305: U$14.5 70.48,9.21 R38.2
REL_DC_LED3
  Top 0.305: U$14.4 R39.2
SENSOR_1
  Top 0.305: R7.1 SENSOR1.1 U$6.3
SENSOR_2
  Top 0.305: SENSOR2.1 R8.1
  Bottom 0.305: SENSOR2.1 55.72,31.43 56.99,30.16 58.9,30.16 U$6.2
SENSOR_3
  Top 0.305: SENSOR3.1 R9.1
  Bottom 0.305: U$6.1 60.17,26.99 58.9,28.26 58.9,28.89 58.26,29.53 56.52,29.53 55.88,30.16 54.61,30.16 54.29,30.16 53.02,31.43 SENSOR3.1
SENSOR_+3V3  (via drill 0.38 pad 0.99)
  Top 0.305: U$6.8 60.17,44.93 58.9,46.2 58.9,46.99 58.42,47.47 51.75,47.47 51.28,46.99 51.28,38.42 51.28,37.62 51.75,37.15 51.83,37.07 | 51.83,37.07 51.89,37.01 SJ5.2 | SJ1.2 SJ3.2 SJ5.2 | SJ5.2 53.31,37.01 | 51.83,37.07 51.28,36.51 51.28,26.19 51.59,25.88 v53.82,25.88
  Bottom 0.305: v53.82,25.88 SJ7.2
SENSOR_+5V
  Bottom 0.305: U$6.9 59.37,47.47 51.75,47.47 51.28,46.99 51.28,37.78 51.28,37.62 51.75,37.15 51.89,37.01 SJ6.2 SJ4.2 SJ2.2
SENSOR_GND
  pour Bottom (isolate 0.305): 61.44,24.77 61.44,48.26 50.48,48.26 50.48,24.77
  pour Top (isolate 0.305): 61.44,24.77 61.44,48.26 50.48,48.26 50.48,24.77
SENSOR_LED1
  Top 0.305: R10.1 57.9,46.08 58.9,45.08 58.9,41.12 60.17,39.85 U$6.6
SENSOR_LED2
  Top 0.305: R11.1 55.36,46.08 56.36,45.08 56.36,40.96 56.99,40.32 58.26,40.32 58.9,39.69 58.9,38.58 60.17,37.31 U$6.5
SENSOR_LED3
  Top 0.305: R12.1 52.82,46.08 53.82,45.08 53.82,40.96 54.45,40.32 55.72,40.32 56.36,39.69 56.36,38.42 56.99,37.78 58.26,37.78 58.74,37.78 58.9,37.62 58.9,37.15 58.9,36.04 60.17,34.77 U$6.4
SENSOR_PULL  (via drill 0.38 pad 0.99)
  Top 0.305: R7.2 57.58,26.94 R7.2 | R9.2 R8.2 | R8.2 R7.2 | v56.36,25.88 55.88,26.35 55.13,27.1 R8.2
  Bottom 0.305: SJ8.1 v56.36,25.88 55.72,25.88 55.09,26.51 54.93,26.67 54.93,27.62 54.45,28.1 53.84,28.1 | 53.84,28.1 SJ7.1 53.84,28.1
VALVE_+3V3  (via drill 0.38 pad 0.99)
  Top 0.305: 37.83,7.46 R3.1 36.51,7.41 | 36.51,7.41 R4.1 | SENSOR5.2 40.32,1.59 35.88,1.59 35.24,2.22 R4.1 | R5.1 v34.92,18.89 R6.1 | R4.1 35.67,7.41 | v36.51,10.64 36.51,8.26 36.51,7.41
  Bottom 0.305: U$2.8 46.67,20.64 46.67,21.91 46.2,22.7 35.56,22.7 34.92,22.7 34.45,22.23 34.45,19.37 v34.92,18.89 34.45,18.41 34.45,13.49 34.92,13.02 36.2,13.02 36.51,12.38 v36.51,10.64
VALVE_+5V
  Top 0.61: L9110.3 L9110.2 45.35,17.94 C1.1 C2.1 45.61,20.32 46.67,20.32 U$2.9
VALVE_CLOSED
  Top 0.305: VALVE.4 R3.2 | U$2.2 46.67,5.4 44.77,5.4 44.13,6.03 44.13,7.46 43.66,7.94 40.64,7.94 39.53,7.94 38.42,9.05 38.15,9.05 R3.2 | 37.83,9.37 R3.2
VALVE_CONTROL1  (via drill 0.38 pad 0.99)
  Top 0.305: 35.13,22.27 R6.2 35.35,22.7 39.69,22.7 40.32,22.07 40.32,20.8 39.37,19.84 v39.37,19.21
  Top 0.406: v39.37,19.21 L9110.6 | U$2.6 47.47,13.81 45.4,13.81 v44.45,14.76
  Bottom 0.406: v39.37,19.21 41.91,19.21 44.45,16.67 v44.45,14.76
VALVE_CONTROL2  (via drill 0.38 pad 0.99)
  Top 0.305: 34.97,15.51 R5.2 34.92,13.97 35.24,13.65 39.37,13.65 39.85,14.13 39.85,17.46 v39.37,17.94
  Top 0.406: v39.37,17.94 L9110.7 | U$2.5 46.67,13.02 v44.45,13.02
  Bottom 0.406: v39.37,17.94 42.07,17.94 43.5,16.51 43.5,13.97 v44.45,13.02
VALVE_GND  (via drill 0.38 pad 0.99)
  other vias: 39.05,21.43 37.47,15.24 41.43,1.27 39.85,3.18 43.81,21.59
  pour Top (isolate 0.305): 49.21,0 49.21,23.5 33.66,23.5 33.66,0
  pour Bottom (isolate 0.305): 49.21,0 49.21,23.5 33.66,23.5 33.66,0
VALVE_LED
  Bottom 0.305: U$2.4 VLV_LED.1
VALVE_OPENED
  Top 0.305: R4.2 35.24,9.89 VALVE.5 36.83,13.02 38.73,13.02 39.05,12.38 39.05,10.48 39.05,9.37 39.85,8.57 40.96,8.57 44.13,8.57 44.77,7.94 46.67,7.94 U$2.3
VALVE_SENSOR3
  Top 0.305: U$2.1 SENSOR5.1 45.4,1.86 R1.1

### Text on the board
tPlace: NC | COM | A5-SCL | 5V | 3 | 2 | 1 | 5V | U8 | 3V | 3V | LEDS | A4-SDA | GN | + | GN | A3 | O1 | O1 | D3 | O2 | O2 | D5 | 3V | + | + | O3 | + | O3 | D6 | AC Relay / 1.1 | INP1 | + | I1 | I1 | GN | I2 | I2 | 3V | INP2 | + | LED3 | + | I3 | I3 | 5V | INPUTS | 3 | 2 | 1 | I2C 1.0 | NO | COM | INPUT3 | INPUT2 | INPUT1 | 3V | PULL DOWN | + | + | + | 5V | Valve 1.0 | 5V | 5V | I3 | GN | 3V | 3V | 3V | 12V / INPUT | LED1 | I2 | INPUT1 | INPUT2 | INPUT3 | GN | GN | GN | NO | OUT2 | + | I1 | + | + | + | O1 | O1 | 5V | D6 | SENSOR | O3 | + | O2 | OPN | CLS | O2 | GN | D5 | LED3 | COM | TR1 | O2 | O3 | I1 | I2 | OPN | CLS | GN | O3 | D3 | + | + | + | OUT1 | CONTROL | + | O1 | + | I1 | I1 | EC2 | A3 | LED2 | NC | OUT3 | LED3 | GN | I2 | I2 | SWITCH3 | 3V | INP3 | + | PULL DOWN | Prot DC Input 1.0 | I3 | I3 | 5V | DC Relay 1.1 | PULL DOWN
tNames: + | +
bNames: Sensor 1.0 | LEDS | 3 | 2 | 1 | 5V | INPUTS | 3 | 2 | 1 | 3V | GN | SENSOR / PULLS | Parking 1.0 | Valve 1.0